# Altium schematic sheet project.SchDoc
size A; SheetNumber: 1; SheetTotal: 1
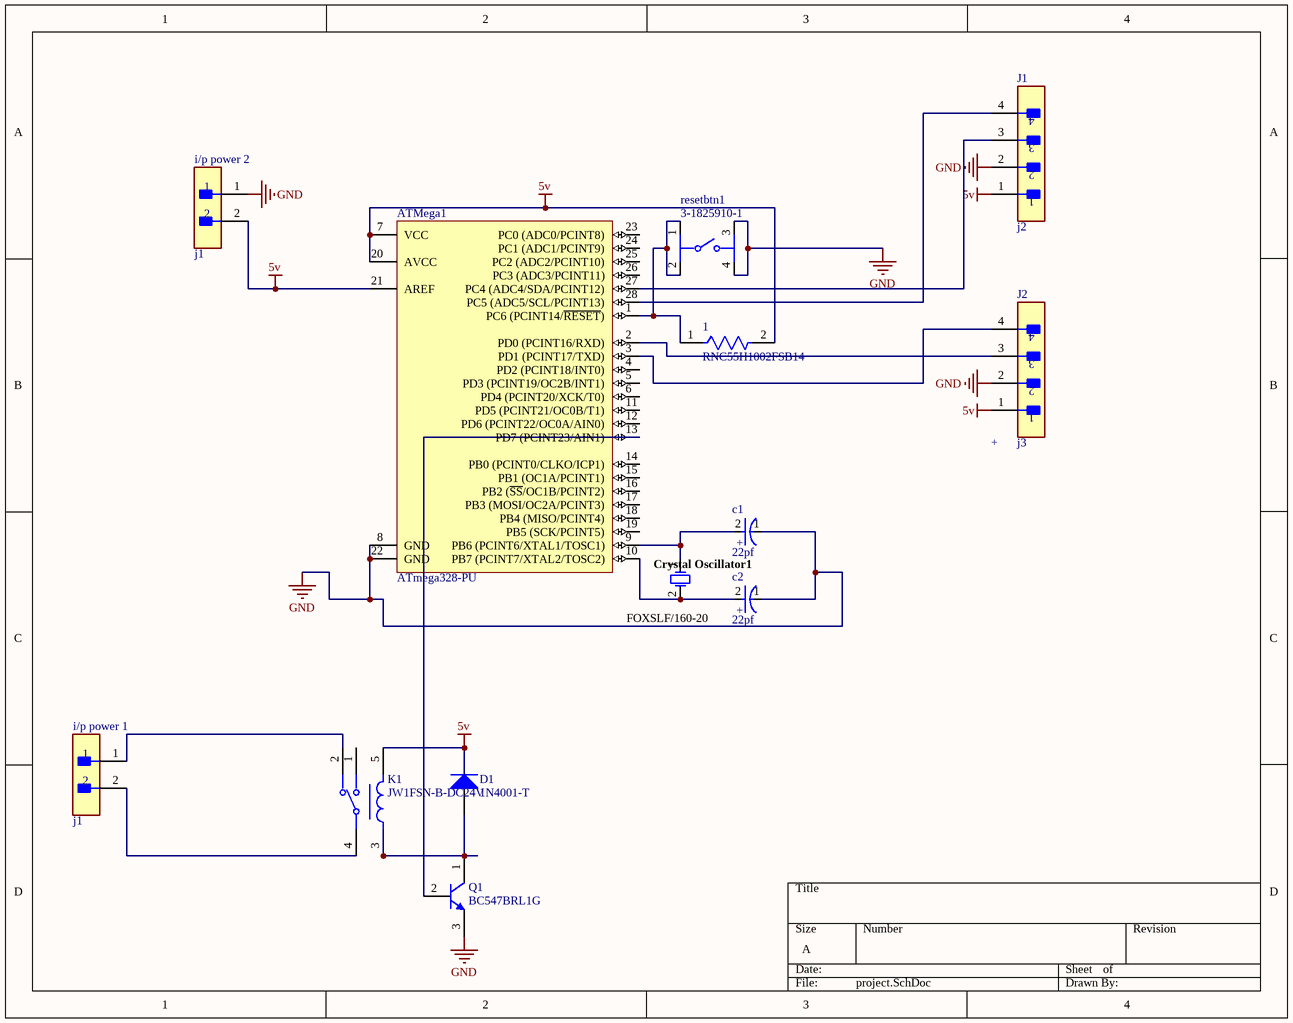
[diagram p0: project.SchDoc]

## Parts
1  RNC55H1002FSB14  [FP-RNC55-MFG]
ATMega1  ATmega328-PU  [28P3]
c1  22pf  [FP-RAD-TH-D_10_0_5-L_20_2-MFG]
c2  22pf  [FP-RAD-TH-D_10_0_5-L_20_2-MFG]
Crystal_Oscillator1  FOXSLF/160-20  [FOX-FOXSLF160-20]
D1  1N4001-T  [DIOD-DO-41-P-2_V]
i/p_power_1  j1  [FP-22-04-1021-MFG]
i/p_power_2  j1  [FP-22-04-1021-MFG]
J1  j2  [FP-47053-3000-MFG]
J2  j3  [FP-47053-3000-MFG]
K1  JW1FSN-B-DC24V  [FP-JW1FSN-B-DC24V-MFG]
Q1  BC547BRL1G  [ONSC-TO-92-3-29-11_AM_BL]
resetbtn1  3-1825910-1  [FP-3-1825910-1-MFG]

## Nets
5v: 1.2 ATMega1.7(VCC) ATMega1.20(AVCC) ATMega1.21(AREF) D1.2(K) i/p_power_2.2 J1.1 J2.1 K1.5
GND: ATMega1.8(GND) ATMega1.22(GND) c1.1(C) c2.1(C) i/p_power_2.1 J1.2 J2.2 Q1.3(E) resetbtn1.3 resetbtn1.4
Net1_1: 1.1 ATMega1.1(PC6_(PCINT14/~{RESET})) resetbtn1.1 resetbtn1.2
NetATMega1_2: ATMega1.2(PD0_(PCINT16/RXD)) J2.3
NetATMega1_3: ATMega1.3(PD1_(PCINT17/TXD)) J2.4
NetATMega1_9: ATMega1.9(PB6_(PCINT6/XTAL1/TOSC1)) c1.2(A) Crystal_Oscillator1.1
NetATMega1_10: ATMega1.10(PB7_(PCINT7/XTAL2/TOSC2)) c2.2(A) Crystal_Oscillator1.2
NetATMega1_13: ATMega1.13(PD7_(PCINT23/AIN1)) Q1.2(B)
NetATMega1_27: ATMega1.27(PC4_(ADC4/SDA/PCINT12)) J1.3
NetATMega1_28: ATMega1.28(PC5_(ADC5/SCL/PCINT13)) J1.4
NetD1_1: D1.1(A) K1.3 Q1.1(C)
Neti/p_power_1_1: i/p_power_1.1 K1.2
Neti/p_power_1_2: i/p_power_1.2 K1.4

Not connected (* = marked no-connect by the designer): ATMega1 4(PD2_(PCINT18/INT0)) 5(PD3_(PCINT19/OC2B/INT1)) 6(PD4_(PCINT20/XCK/T0)) 11(PD5_(PCINT21/OC0B/T1)) 12(PD6_(PCINT22/OC0A/AIN0)) 14(PB0_(PCINT0/CLKO/ICP1)) 15(PB1_(OC1A/PCINT1)) 16(PB2_(~{SS}/OC1B/PCINT2)) 17(PB3_(MOSI/OC2A/PCINT3)) 18(PB4_(MISO/PCINT4)) 19(PB5_(SCK/PCINT5)) 23(PC0_(ADC0/PCINT8)) 24(PC1_(ADC1/PCINT9)) 25(PC2_(ADC2/PCINT10)) 26(PC3_(ADC3/PCINT11)); K1 1

## Notes on the sheet
- (near J2) +
- (in symbol CMP-05427-000214-1) +

## Library data of the parts
1 = CMP-02408-000004-1: RES 10K OHM 1/8W 1% AXIAL; Manufacturer: Vishay; Voltage Rating: 200V; Power Rating: 0.125W; Resistance: 10kΩ; Temperature Coefficient: 50ppm/°C; Value: 10kΩ; Automotive: No; Category: Res; Tolerance: 1%; Temperature: -65°C to +175°C; Device Class L2: Resistors; Composition: Metal Film; Height: 2.69mm; Failure Rate: 0.001%; ComponentLink2URL: https://www.vishay.com/docs/31025/erc.pdf; Manufacturer Part Number: RNC55H1002FSB14; Temperature Range High: +175°C; Lead Free: No; Series: RNC; Device Class L1: Passive Components; Ipc Land Pattern Name: RESAD1100W85L762D269; Octopart: https://octopart.com/rnc55h1002fs-vishay-40848808; Package: RNC55; RoHS: FALSE; Military Standard: true; Device Class L3: Through-Hole Resistors; ComponentLink2Description: Datasheet; Digikey Description: RES 10K OHM 1/8W 1% AXIAL; Temperature Range Low: -65°C
ATMega1 = CMP-0095-00015-2: 8-bit AVR Microcontroller, 32KB Flash, 1KB EEPROM, 2KB SRAM, 28-pin PDIP, Industrial Grade (-40°C to 85°C); ComponentLink3Description: ATmega48A/48PA/88A/88PA/168A/168PA/328/328P Summary; RevisionNote: DatasheetVersion updated. URLs added.; DatasheetVersion: revD, May-2011; ComponentLink1URL: http://www.atmel.com/; PackageVersion: revB, Sep-2001; PackageDescription: 28-lead (0.300"/7.62mm Wide) Plastic Dual Inline Package (PDIP); PackageReference: 28P3; ComponentLink1Description: Manufacturer URL; ComponentLink2Description: ATmega48A/48PA/88A/88PA/168A/168PA/328/328P Datasheet; ComponentLink3URL: http://www.atmel.com/dyn/resources/prod_documents/8271S.pdf; ComponentLink2URL: http://www.atmel.com/dyn/resources/prod_documents/8271.pdf
c1 c2 = CMP-05427-000214-1: Aluminum Electrolytic Capacitors (Radial Lead Type) 10uF ±20% 400V; Lead/Base Style: Straight; Lead Diameter: 0.6mm; Dissipation Factor: 0.24%; Ripple Current (AC): 80mA; Life (Hours): 2000Hour; Polarity: Polar; Dielectric Material: Aluminium; Lead Free: Lead Free; Capacitance: 10uF; Tolerance: 20%; Height: 20mm; Number of Pins: 2; Case/Package: Radial; Package Quantity: 200; REACH SVHC: No SVHC; Termination: Radial; Radiation Hardening: No; Diameter: 10mm; RoHS Compliant: Yes; Construction: RADIAL; Max Operating Temperature: 105°C; Voltage Rating: 400V; Mount: Through Hole; Voltage: 400V; Height - Seated (Max): 0.866inch; Lead Pitch: 5mm; Voltage Rating (DC): 400V; Contact Plating: Tin; Length: 20mm; Series: NHG; Min Operating Temperature: -25°C; Packaging: Bulk; Ripple Current: 80mA
Crystal_Oscillator1 = CMP-1749-00003-1: Resistance Weld Thru-Hole Crystal, 16 MHz, -20 to 70 degC, 2-Pin THD, RoHS, Bulk; Voltage Rating: 250 V; Tolerance: 1%; Resistance: 221 kohm; Case\Package: Axial; Power Rating: 250 mW; RoHSCompliant: true; Package Quantity: 200; Packaging: Bulk; Min Operating Temperature: -55 degC; DatasheetVersion: Mar-15; ComponentLink1URL: http://www.foxonline.com/; Max Operating Temperature: 155 degC; PackageReference: FOXSLF160-20; Mount: Through Hole; PackageDescription: 2-Pin Through Hole Device, Body 11.35 x 4.65 mm; ComponentLink1Description: Manufacturer URL; ComponentLink2URL: http://www.foxonline.com/pdfs/hc49slf.pdf; ComponentLink2Description: Datasheet; Length: 0.248 inch
D1 = CMP-0639-00006-2: 1.0 A Rectifier, 15 pF, 50 V, -65 to 150 degC, 2-Pin DO-41 Plastic, RoHS, Tape and Reel; Manufacturer: Diodes Inc; VF (V): 1; CT (pF): 15; Max. IR (uA): 5; VRRM (V): 50; Max. IFSM (A): 30; RoHS: TRUE; Mounting Technology: Through Hole; PartNumber: 1N4001-T; ComponentLink2Description: Datasheet; DatasheetVersion: Rev. 8-2; Operating Temperature Range (degC): -65 to 150; Packing: Tape and Reel; PackageReference: DO-41-P-2; ComponentLink1URL: http://diodes.com/; PackageDescription: 2-Pin Axial Lead, Body 4.635 x 2.36 mm, Lead Spread 25.4 mm; ComponentLink2URL: http://diodes.com/datasheets/ds28002.pdf; Max. Average Rectified Current IO (A): 1; ComponentLink1Description: Manufacturer URL
i/p_power_1 i/p_power_2 = CMP-04776-000257-1: CONN HEADER VERT 2POS 2.5MM; Number of Circuits: 2; Gender: Male; Insulation Resistance: 1GR; Voltage Rating (DC): 250V; Contact Post Length: 0.134inch; Glow Wire Compliant: Non-compliant; Flammability Rating: UL94 V-0; Packaging: Bulk; Contact Mating Length: 0.295inch; Weight: 0.007055oz; Lead Free: Lead Free; Fastening Type: Friction; Contact Type: -; Connector Type: Header; Contact Shape: Square; Insulation Color: Natural; Mount: Through Hole; Halogen Free: Low Halogen; Termination: Through Hole; Contact Plating: Tin; Insulation Height: 0.461inch; RoHS Compliant: Yes; Insulation Material: Nylon; Number of Positions: 2; Series: 5045; Package Quantity: 1000; Number of Rows: 1; Contact Material: Tin
J1 J2 = CMP-04776-000447-1: CONN HEADER VERT 4POS 2.54MM; Glow Wire Compliant: Non-compliant; Voltage Rating: 250V; Current Rating: 4A; Number of Circuits: 4; Gender: Male; Orientation: Straight; Packaging: Bulk; Series: 47053; RoHS Compliant: Yes; Termination: Through Hole; Contact Plating: Tin; Mount: Through Hole; Number of Rows: 1; Pitch: 2.54mm; Halogen Free: Low Halogen; Number of Contacts: 4; Min Operating Temperature: 0°C; Package Quantity: 12000; Contact Material: Copper Alloy; Max Operating Temperature: 75°C; REACH SVHC: No SVHC; Number of Positions: 4
K1 = CMP-05607-000133-1: RELAY GEN PURPOSE SPDT 10A 24V; Coil Type: Non-Latching; Power Rating: 530mW; Voltage Rating (DC): 30V; Voltage Rating (AC): 250V; Coil Resistance: 1.1kR; Relay Type: General Purpose; Coil Current: 22mA; Release Time: 5ms; Operate Time: 15ms; Lead Free: Lead Free; Length: 28.6mm; Depth: 12.8mm; Coil Voltage (DC): 24V; Width: 12.8mm; RoHS Compliant: Yes; Series: JW; Max Current Rating: 10A; Max Voltage Rating (DC): 30V; Coil Power: 530mW; Contact Current Rating: 10A; Power Consumption: 530mW; Contact Material: Silver; Relay Function: SPDT; Contact Plating: Silver; Weight: 13g; Max Operating Temperature: 85°C; Packaging: Bulk; Mount: Through Hole; Termination: PC Pin; Package Quantity: 100; Max Voltage Rating (AC): 250V; Number of Pins: 5; Radiation Hardening: No; Throw Configuration: SPDT; Height: 20mm; Min Operating Temperature: -40°C
Q1 = CMP-1048-01605-1: Amplifier Transistor, NPN Silicon, 3-Pin TO-92, Pb-Free, Tape and Reel; Manufacturer: On Semiconductor; IC Continuous (A): 0.1; fT Min (MHz): 150; ComponentLink2URL: http://www.onsemi.com/pub_link/Collateral/BC546-D.PDF; ComponentLink1URL: http://www.onsemi.com/; ComponentLink2Description: Datasheet; RoHS: TRUE; ComponentLink3Description: Package Specification; ComponentLink1Description: Manufacturer URL; ComponentLink3URL: http://www.onsemi.com/pub_link/Collateral/MAC97-D.PDF; PackageDescription: 3-Pin Transistor Outline, Body 4.825 x 3.685 mm, Pitch 1.27 mm; Packing: Tape and Reel; PackageVersion: Rev. AM; Polarity: NPN; DatasheetVersion: Rev. 7; Mounting Technology: Through Hole; PackageReference: TO-92-3-29-11_AM_BL; PartNumber: BC547BRL1G
resetbtn1 = CMP-03407-000001-1: SWITCH TACTILE SPST-NO 0.05A 24V; Manufacturer: TE Connectivity; Operating Force: 160gf; Contact Current Rating: 50mA; Contact Resistance: 100mΩ; Electromechanical Life: 100000Cycles; Device Class L1: Electromechanical; ComponentLink2URL: https://www.te.com/commerce/DocumentDelivery/DDEController?Action=srchrtrv&DocNm=1825910&DocType=Customer+Drawing&DocLang=English; Category: Switch; Device Class L2: Switches; Temperature: -35°C to +85°C; RoHS: TRUE; Mount: Through Hole; Manufacturer Part Number: 3-1825910-1; Automotive: No; Lead Free: Yes; Device Class L3: Tactile Switches; ComponentLink2Description: Datasheet; Temperature Range High: +85°C; Height: 17.3mm; Package: 0; Temperature Range Low: -35°C; Throw Configuration: SPST-NO; Digikey Description: SWITCH TACTILE SPST-NO 0.05A 24V; Octopart: https://octopart.com/3-1825910-1-te+connectivity-46506874